# EAGLE design MultiWiiChassis_quadmini_power (EAGLE 6.4)
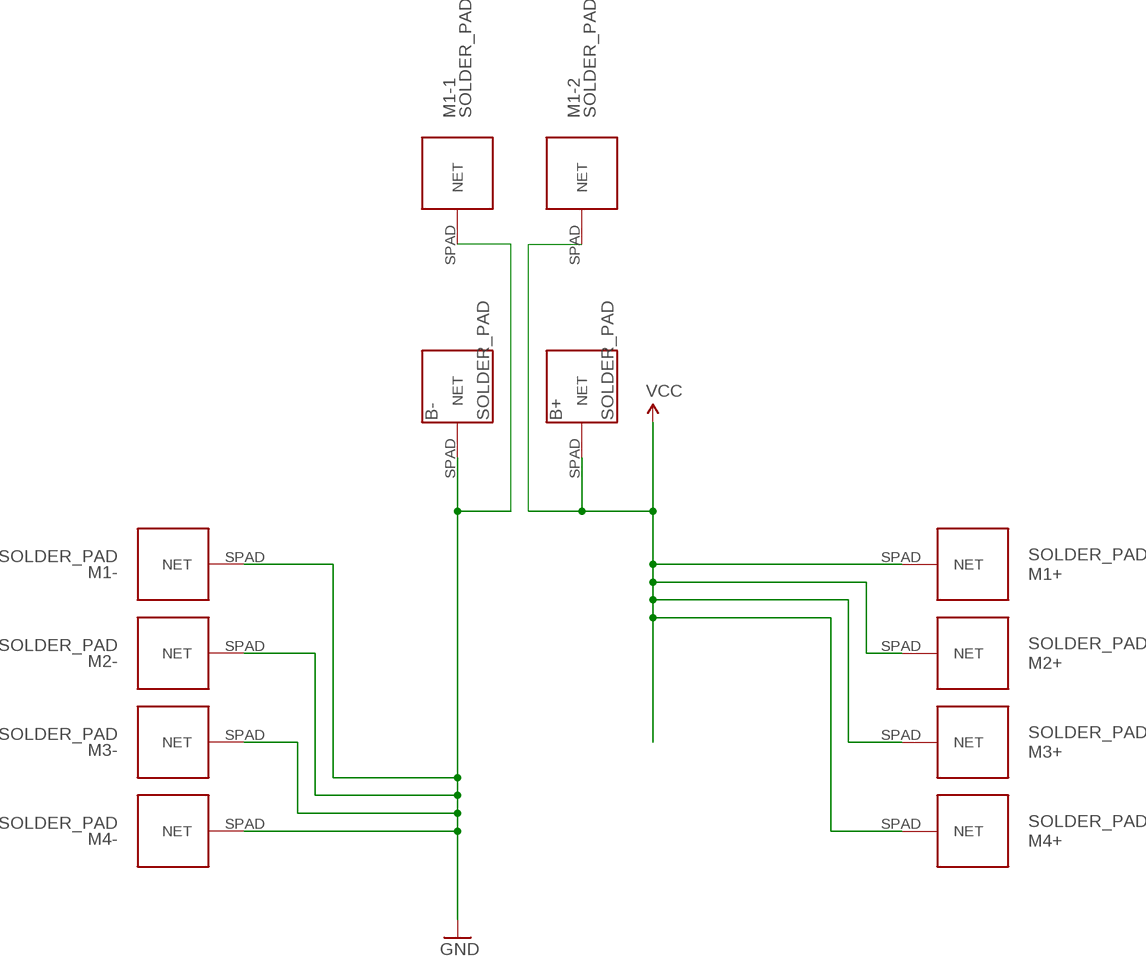
[diagram p0: schematic, sheet 1]

## Parts
B+  SOLDER_PAD  [SOLDER_PAD]
B-  SOLDER_PAD  [SOLDER_PAD]
M1+  SOLDER_PAD  [SOLDER_PAD]
M1-  SOLDER_PAD  [SOLDER_PAD]
M1-1  SOLDER_PAD  [SOLDER_PAD]
M1-2  SOLDER_PAD  [SOLDER_PAD]
M2+  SOLDER_PAD  [SOLDER_PAD]
M2-  SOLDER_PAD  [SOLDER_PAD]
M3+  SOLDER_PAD  [SOLDER_PAD]
M3-  SOLDER_PAD  [SOLDER_PAD]
M4+  SOLDER_PAD  [SOLDER_PAD]
M4-  SOLDER_PAD  [SOLDER_PAD]

## Nets
GND: B-.SPAD(NET) M1-1.SPAD(NET) M1-.SPAD(NET) M2-.SPAD(NET) M3-.SPAD(NET) M4-.SPAD(NET)
VCC: B+.SPAD(NET) M1+.SPAD(NET) M1-2.SPAD(NET) M2+.SPAD(NET) M3+.SPAD(NET) M4+.SPAD(NET)

## Library data of the parts
B+ B- M1+ M1- M1-1 M1-2 M2+ M2- M3+ M3- M4+ M4- = JCM:SOLDER_PAD

## Board
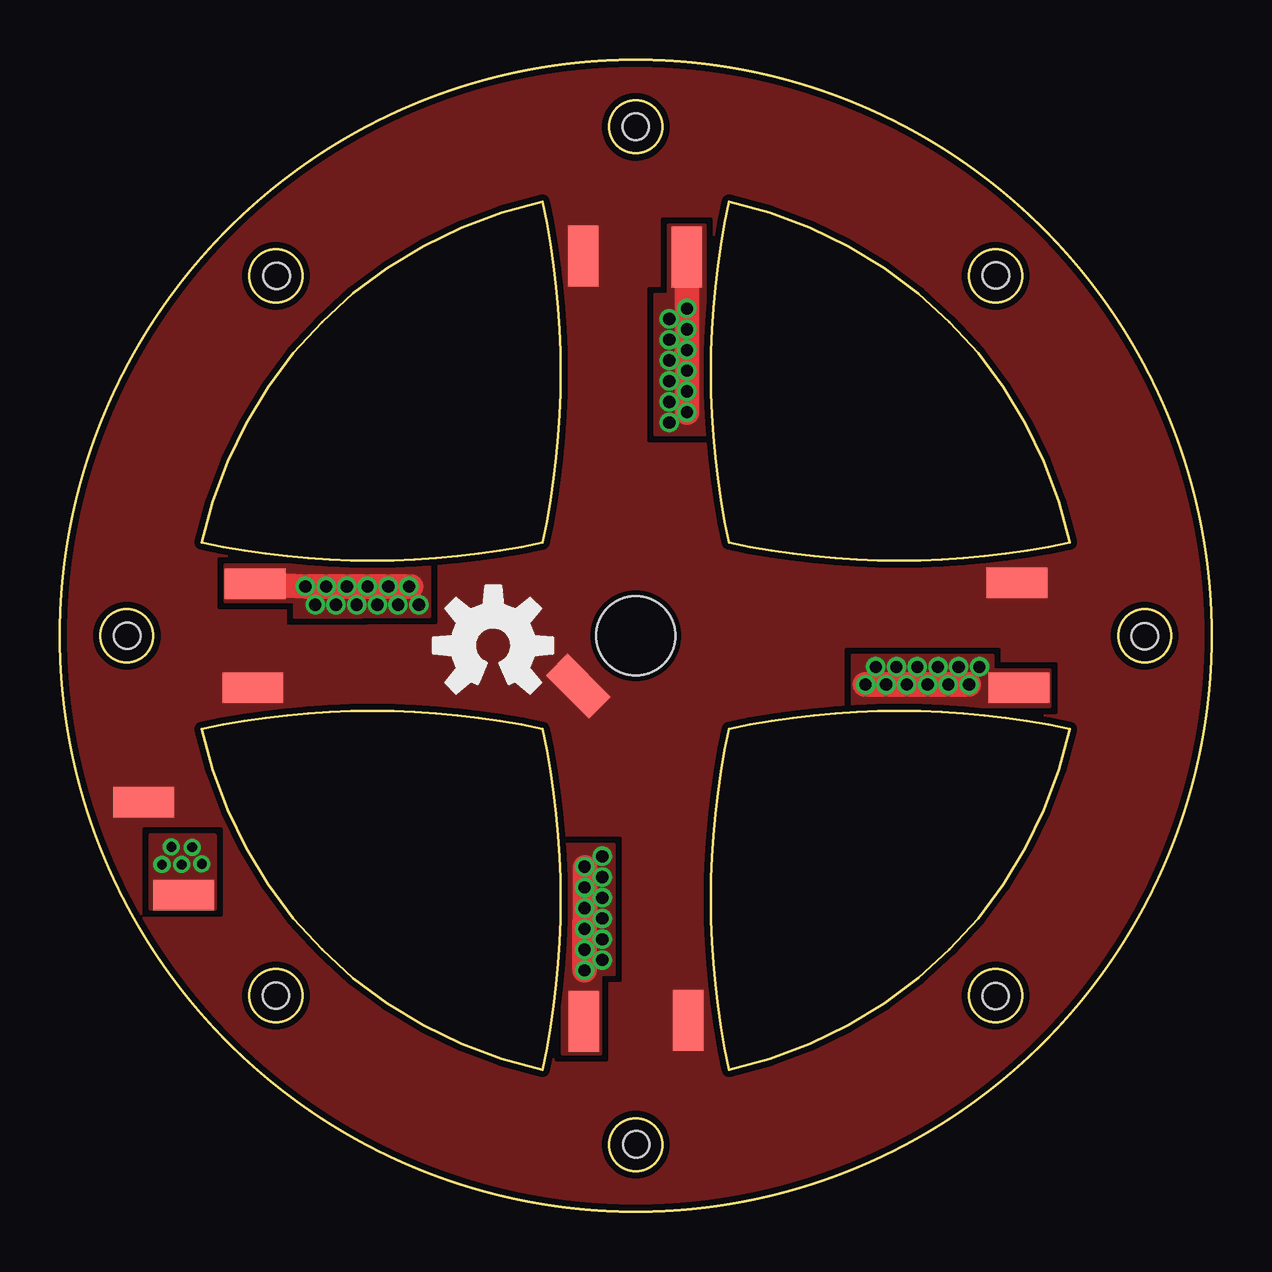
[diagram p1: board, top side]
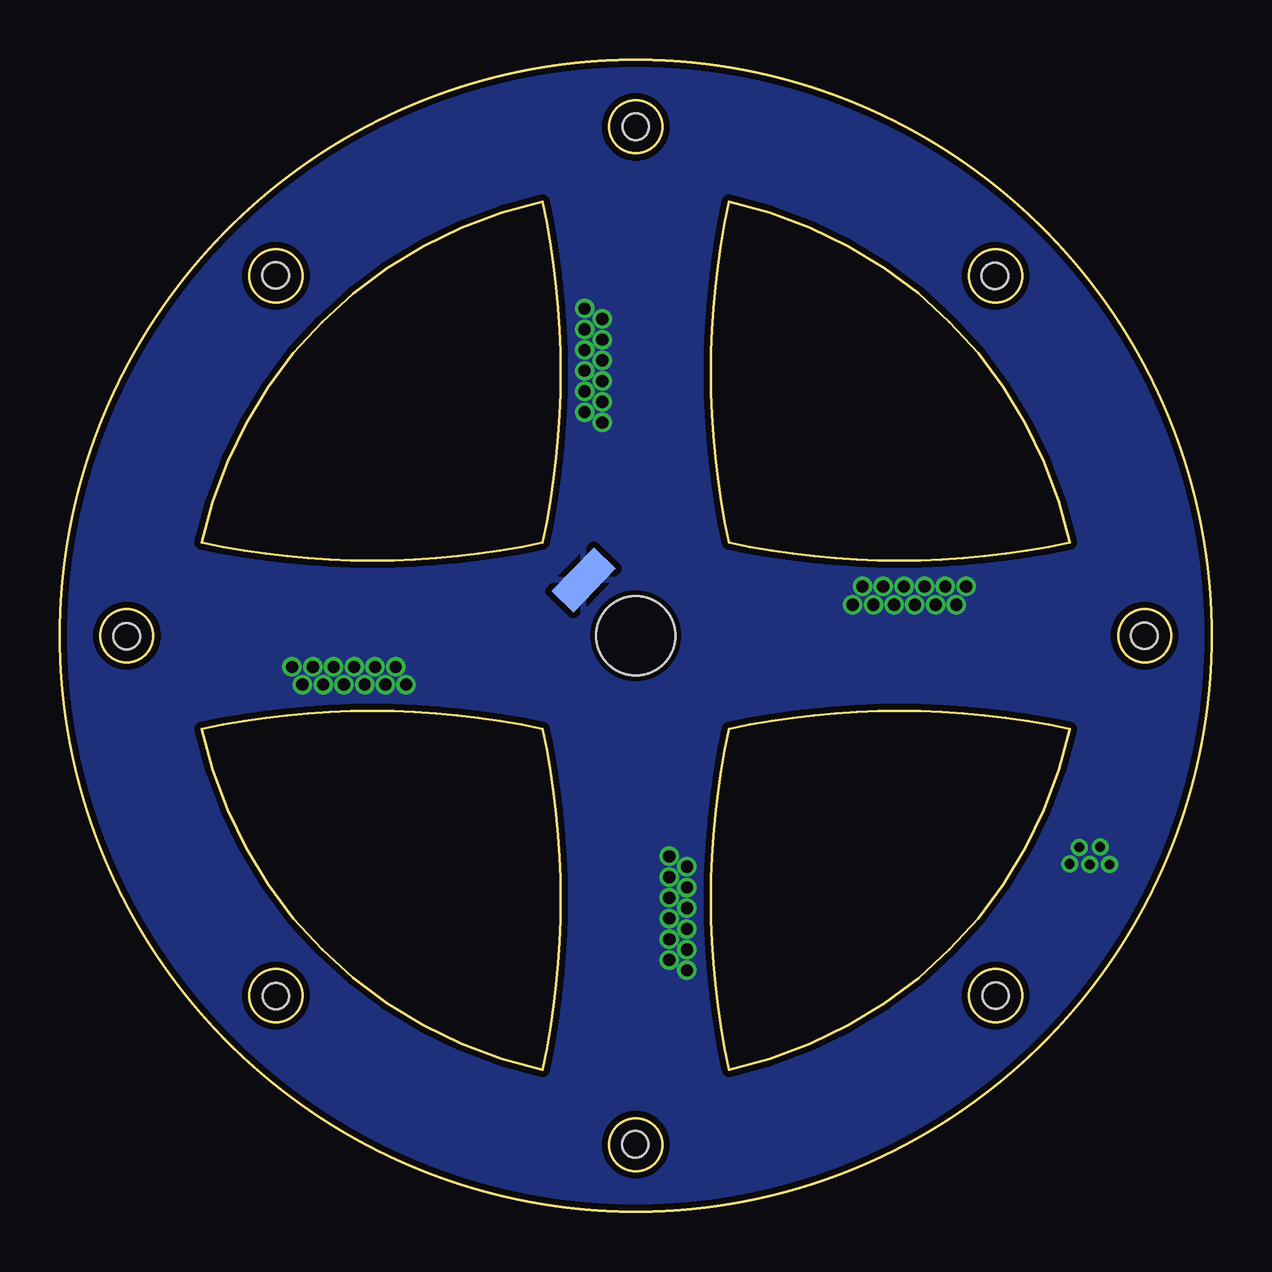
[diagram p2: board, bottom side, seen from below]

Size 48 x 48 mm. Coordinates in mm from the lower left corner, seen from the top.
Outline: 5.91,20.12 arc66 20.12,5.91 20.12,5.92 20.29,6.8 20.45,7.69 20.58,8.58 20.68,9.47 20.76,10.35 20.82,11.24 20.86,12.13 20.87,13.02 20.86,13.9 20.82,14.79 20.76,15.68 20.68,16.57 20.58,17.45 20.45,18.34 20.29,19.23 20.12,20.11 20.12,20.12
Outline: 5.91,20.12 5.91,20.12 6.8,20.3 7.69,20.45 8.57,20.58 9.46,20.68 10.35,20.76 11.24,20.82 12.13,20.86 13.02,20.87 13.9,20.86 14.79,20.82 15.68,20.76 16.57,20.68 17.45,20.58 18.34,20.45 19.23,20.3 20.12,20.12
Outline: 20.12,20.12 20.12,20.12
Outline: 20.12,20.12 20.12,20.12
Outline: 20.12,20.12 20.12,20.12
Outline: 20.12,20.12 20.12,20.12
Outline: 20.12,20.12 20.12,20.12
Outline: 20.12,20.12 20.12,20.12
Outline: 20.12,20.12 20.12,20.12
Outline: 20.12,20.12 20.12,20.12
Outline: 20.12,20.12 20.12,20.12
Outline: 20.12,20.12 20.12,20.12
Outline: 20.12,20.12 20.12,20.12
Outline: 20.12,20.12 20.12,20.12
Outline: 20.12,20.12 20.12,20.12
Outline: 20.12,20.12 20.12,20.12
Outline: 20.12,20.12 20.12,20.12
Outline: 20.12,20.12 20.12,20.12
Outline: 42.09,20.12 42.09,20.12
Outline: 42.09,20.12 41.2,20.29 40.31,20.45 39.42,20.58 38.54,20.68 37.65,20.76 36.76,20.82 35.87,20.86 34.98,20.87 34.1,20.86 33.21,20.82 32.32,20.76 31.43,20.68 30.55,20.58 29.66,20.45 28.77,20.29 27.88,20.12 27.7,19.23 27.55,18.34 27.42,17.45 27.32,16.57 27.24,15.68 27.18,14.79 27.14,13.9 27.13,13.02 27.14,12.13 27.18,11.24 27.24,10.35 27.32,9.46 27.42,8.57 27.55,7.69 27.7,6.8 27.88,5.91 27.88,5.91
Outline: 27.88,5.91 arc66 42.09,20.12
Outline: 27.88,42.09 27.88,42.09 27.71,41.2 27.55,40.31 27.42,39.42 27.32,38.54 27.24,37.65 27.18,36.76 27.14,35.87 27.13,34.98 27.14,34.1 27.18,33.21 27.24,32.32 27.32,31.43 27.42,30.55 27.55,29.66 27.71,28.77 27.88,27.88 28.77,27.7 29.66,27.55 30.55,27.42 31.43,27.32 32.32,27.24 33.21,27.18 34.1,27.14 34.98,27.13 35.87,27.14 36.76,27.18 37.65,27.24 38.54,27.32 39.42,27.42 40.31,27.55 41.2,27.7 42.09,27.88 42.09,27.88
Outline: 42.09,27.88 arc66 27.88,42.09
Outline: 5.91,27.88 5.91,27.88
Outline: 5.91,27.88 6.8,27.71 7.69,27.55 8.58,27.42 9.46,27.32 10.35,27.24 11.24,27.18 12.13,27.14 13.02,27.13 13.9,27.14 14.79,27.18 15.68,27.24 16.57,27.32 17.45,27.42 18.34,27.55 19.23,27.71 20.12,27.88 20.3,28.77 20.45,29.66 20.58,30.55 20.68,31.43 20.76,32.32 20.82,33.21 20.86,34.1 20.87,34.98 20.86,35.87 20.82,36.76 20.76,37.65 20.68,38.54 20.58,39.42 20.45,40.31 20.3,41.2 20.12,42.09 arc66 5.91,27.88
Outline: circle at 2.79,24 radius 1.1
Outline: circle at 9,39 radius 1.1
Outline: circle at 24,45.21 radius 1.1
Outline: circle at 39,39 radius 1.1
Outline: circle at 45.21,24 radius 1.1
Outline: circle at 39,9 radius 1.1
Outline: circle at 24,2.79 radius 1.1
Outline: circle at 9,9 radius 1.1
Outline: circle at 24,24 radius 24
Copper layers (1*16): Top 0.035mm / dielectric 1.5mm / Bottom 0.035mm
Design rules "Fusion_eagle_rule_v1.1": minimum track width 6mil, minimum drill 12mil, track to track 6mil, track to pad 6mil, pad to pad 6mil, via to via 6mil, smd to smd 0mil, copper to edge 10mil, drill to drill 10mil, minimum pad ring 10mil, minimum via ring 6mil, stop-mask expansion 2mil, vias tented up to drill 100mil, thermal gap 10mil
Holes 1.1 mm at 24,45.22 45.22,23.98 24.02,2.8 2.8,24 9,9 9.03,39 39,8.98 39.01,39.02
Holes 3.28 mm at 24,24
vRestrict: 3 lines

### Footprints (pad centres in the part's own frame; a part is rotated, then mirrored left to right if it is on the bottom)
SOLDER_PAD = smd 2.54 x 1.27: SPAD 0,0

### Placement (x,y rotation side)
B+  21.6,21.9 315 top
B-  26.18,26.33 46 bottom
M1+  21.81,39.82 90 top
M1-  26.13,39.77 90 top
M1-1  5.15,13.19 180 top
M1-2  3.48,17.05 180 top
M2+  8.04,21.83 0 top
M2-  8.13,26.16 0 top
M3+  26.19,7.97 90 top
M3-  21.84,7.92 90 top
M4+  39.88,26.21 0 top
M4-  39.96,21.83 0 top
U$2  [OSHW-LOGO-M]  18.05,23.59 0 top

### Tracks (layer width: path | path; a pad name or v marks a point on that pad's centre or on a via)
GND  (via drill 0.41, 0.51)
  Top 1.016: 14.63,26.06 v10.23,26.06 M2-.SPAD | 26.13,33.3 v26.13,37.64 M1-.SPAD | v21.87,10.05 21.89,14.35 | v37.89,21.97 33.55,21.97
  other vias: 11.1,26.06 11.96,26.06 12.82,26.06 13.69,26.06 14.55,26.06 26.13,33.32 26.13,34.18 26.13,35.05 26.13,35.91 26.13,36.77 33.57,21.97 34.44,21.97 35.3,21.97 36.16,21.97 37.03,21.97 21.86,10.92 21.86,11.78 21.86,12.64 21.86,13.51 21.86,14.37 10.64,25.29 11.5,25.29 12.37,25.29 13.23,25.29 14.09,25.29 14.96,25.29 25.4,32.89 25.4,33.75 25.4,34.62 25.4,35.48 25.4,36.34 25.4,37.21 34.01,22.7 34.87,22.7 35.73,22.7 36.6,22.7 37.46,22.7 38.32,22.7 22.6,10.49 22.6,11.35 22.6,12.21 22.6,13.08 22.6,13.94 22.6,14.8 4.25,14.46 5.08,14.46 5.91,14.49 5.51,15.18 4.64,15.2
  pour Bottom (rank 2): -0.08,48.13 48.79,48.74 48.28,-1.2 -1.25,-0.23
  pour Top (no thermals): 6.88,26.74 6.88,25.42 9.77,25.42 9.77,24.96 9.77,24.76 15.41,24.81 15.41,26.94 6.88,26.94
  pour Top (no thermals): 24.81,32.38 24.81,38.22 25.37,38.22 25.37,41.12 26.89,41.12 26.89,32.38
  pour Top (no thermals): 41.27,22.58 38.88,22.58 38.88,23.19 33.04,23.19 33.04,21.05 41.27,21.05
  pour Top (no thermals): 20.95,15.31 20.95,6.57 22.53,6.57 22.53,9.88 23.08,9.88 23.08,15.31
  pour Top (no thermals): 3.82,15.67 6.43,15.67 6.43,12.63 3.79,12.63 3.79,15.68
VCC
  pour Top (isolate 0.254, rank 2, no thermals): 48.74,48.48 48.08,-0.64 -0.84,-0.59 -0.23,47.82

### Text on the board
tDocu: Engineering LLC | NanoQuad | J Moreland | Power v2.0 | + | - | MultiWiiChassis